# EAGLE design CNY70 (EAGLE 9.4.1)
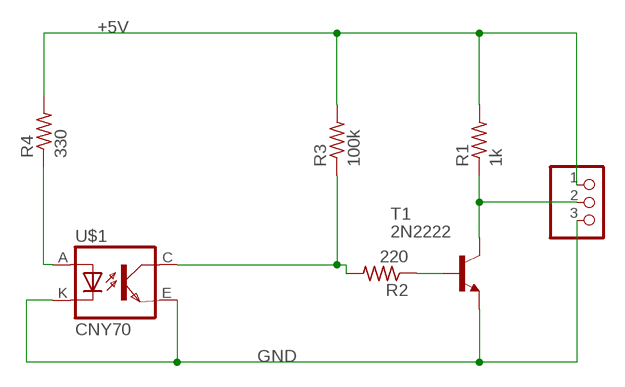
[diagram p0: schematic, sheet 1]

## Parts
JP1  PINHD-1X3  [1X03]
R1  1k  R-US_0207/10  [0207/10]
R2  220  R-US_0207/10  [0207/10]
R3  100k  R-US_0207/10  [0207/10]
R4  330  R-US_0207/10  [0207/10]
T1  2N2222  [TO92-EBC-OVAL]
U$1  CNY70  [4]

## Nets
+5V: JP1.1 R1.2 R3.2 R4.2
GND: JP1.3 T1.E U$1.E(EMI) U$1.K(C)
N$1: R2.2 R3.1 U$1.C(COL)
N$2: R2.1 T1.B
N$3: R4.1 U$1.A
N$4: JP1.2 R1.1 T1.C

## Library data of the parts
JP1 = adafruit:PINHD-1X3: PIN HEADER
R1-R4 = rcl:R-US_: RESISTOR, American symbol; SPICEPREFIX: R
T1 = adafruit:2N2222: NPN TRANSISTOR Big oval pads
U$1 = cny70:CNY70

## Board
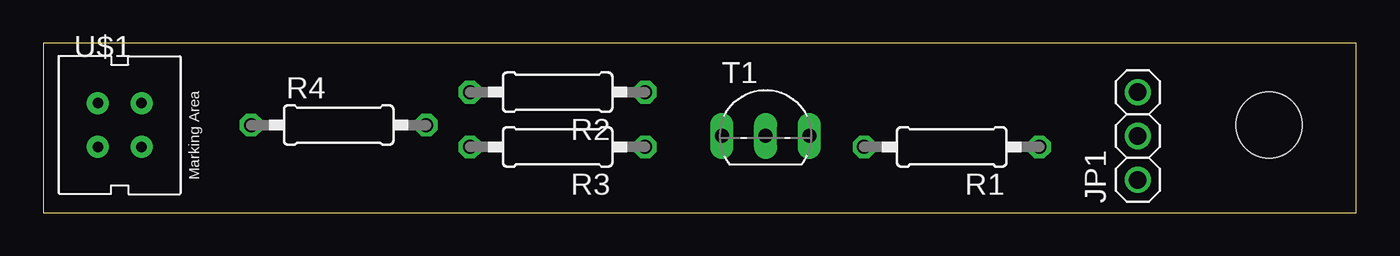
[diagram p1: board, top side]
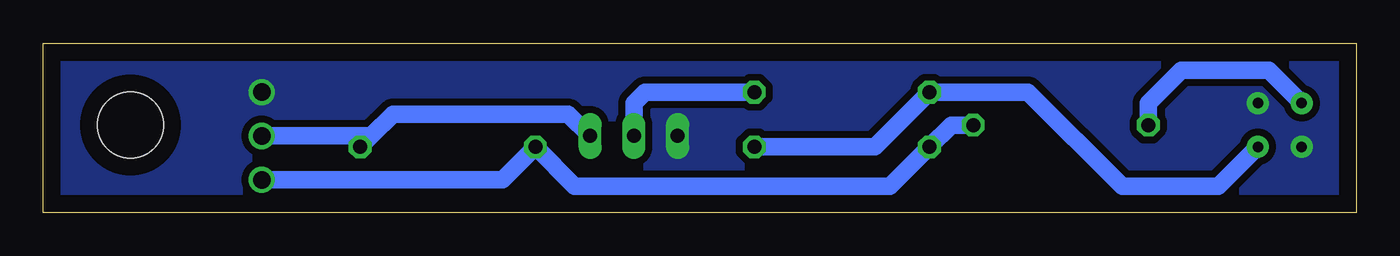
[diagram p2: board, bottom side, seen from below]

Size 76.18 x 9.83 mm. Coordinates in mm from the lower left corner, seen from the top.
Outline: 0,0 76.18,0 76.18,9.83 0,9.83 0,0
Copper layers (1*16): Top 0.035mm / dielectric 1.5mm / Bottom 0.035mm
Design rules "default": minimum track width 6mil, minimum drill 0.35mm, track to track 6mil, track to pad 6mil, pad to pad 6mil, via to via 6mil, smd to smd 6mil, copper to edge 40mil, drill to drill 6mil, minimum pad ring 10mil, minimum via ring 8mil, stop-mask expansion 4mil, vias tented up to drill 0mil, thermal gap 10mil
Holes 3.81 mm at 71.12,5.08

### Footprints (pad centres in the part's own frame; a part is rotated, then mirrored left to right if it is on the bottom)
1X03 = drill 1.016: 1 -2.54,0; 2 0,0; 3 2.54,0
0207/10 = drill 0.813 octagon: 1 -5.08,0; 2 5.08,0
TO92-EBC-OVAL = drill 0.813 long: B 0,-1.27; C 2.54,-1.27; E -2.54,-1.27
4 = drill 0.61 pad 1.27: A -1.27,1.27; C 1.27,-1.27; E 1.27,1.27; K -1.27,-1.27

### Placement (x,y rotation side)
JP1  63.5,4.45 90 top
R1  52.7,3.81 180 top
R2  29.84,6.99 180 top
R3  29.84,3.81 180 top
R4  17.14,5.08 0 top
T1  41.91,5.71 0 top
U$1  4.45,5.08 0 top

### Tracks (layer width: path | path; a pad name or v marks a point on that pad's centre or on a via)
+5V
  Bottom 1.016: JP1.1 49.53,1.91 R1.2 45.34,1.52 27.05,1.52 R3.2 23.5,5.08 R4.2
GND
  pour Bottom (isolate 0.406, no thermals): 0,9.53 75.56,9.53 75.56,0.64 0,0.64
N$1
  Bottom 1.016: R3.1 27.94,3.81 R2.2 19.05,6.99 13.59,1.52 8,1.52 U$1.C
N$2
  Bottom 1.016: T1.B 41.91,6.35 41.27,6.99 R2.1
N$3
  Bottom 1.016: U$1.A 5.08,8.26 10.16,8.26 12.06,6.35 R4.1
N$4
  Bottom 1.016: 57.15,4.45 55.88,5.71 45.72,5.71 T1.C | 57.15,4.45 R1.1 | JP1.2 57.15,4.45